# Altium schematic sheet 14.SchDoc
size 297 x 209 mm
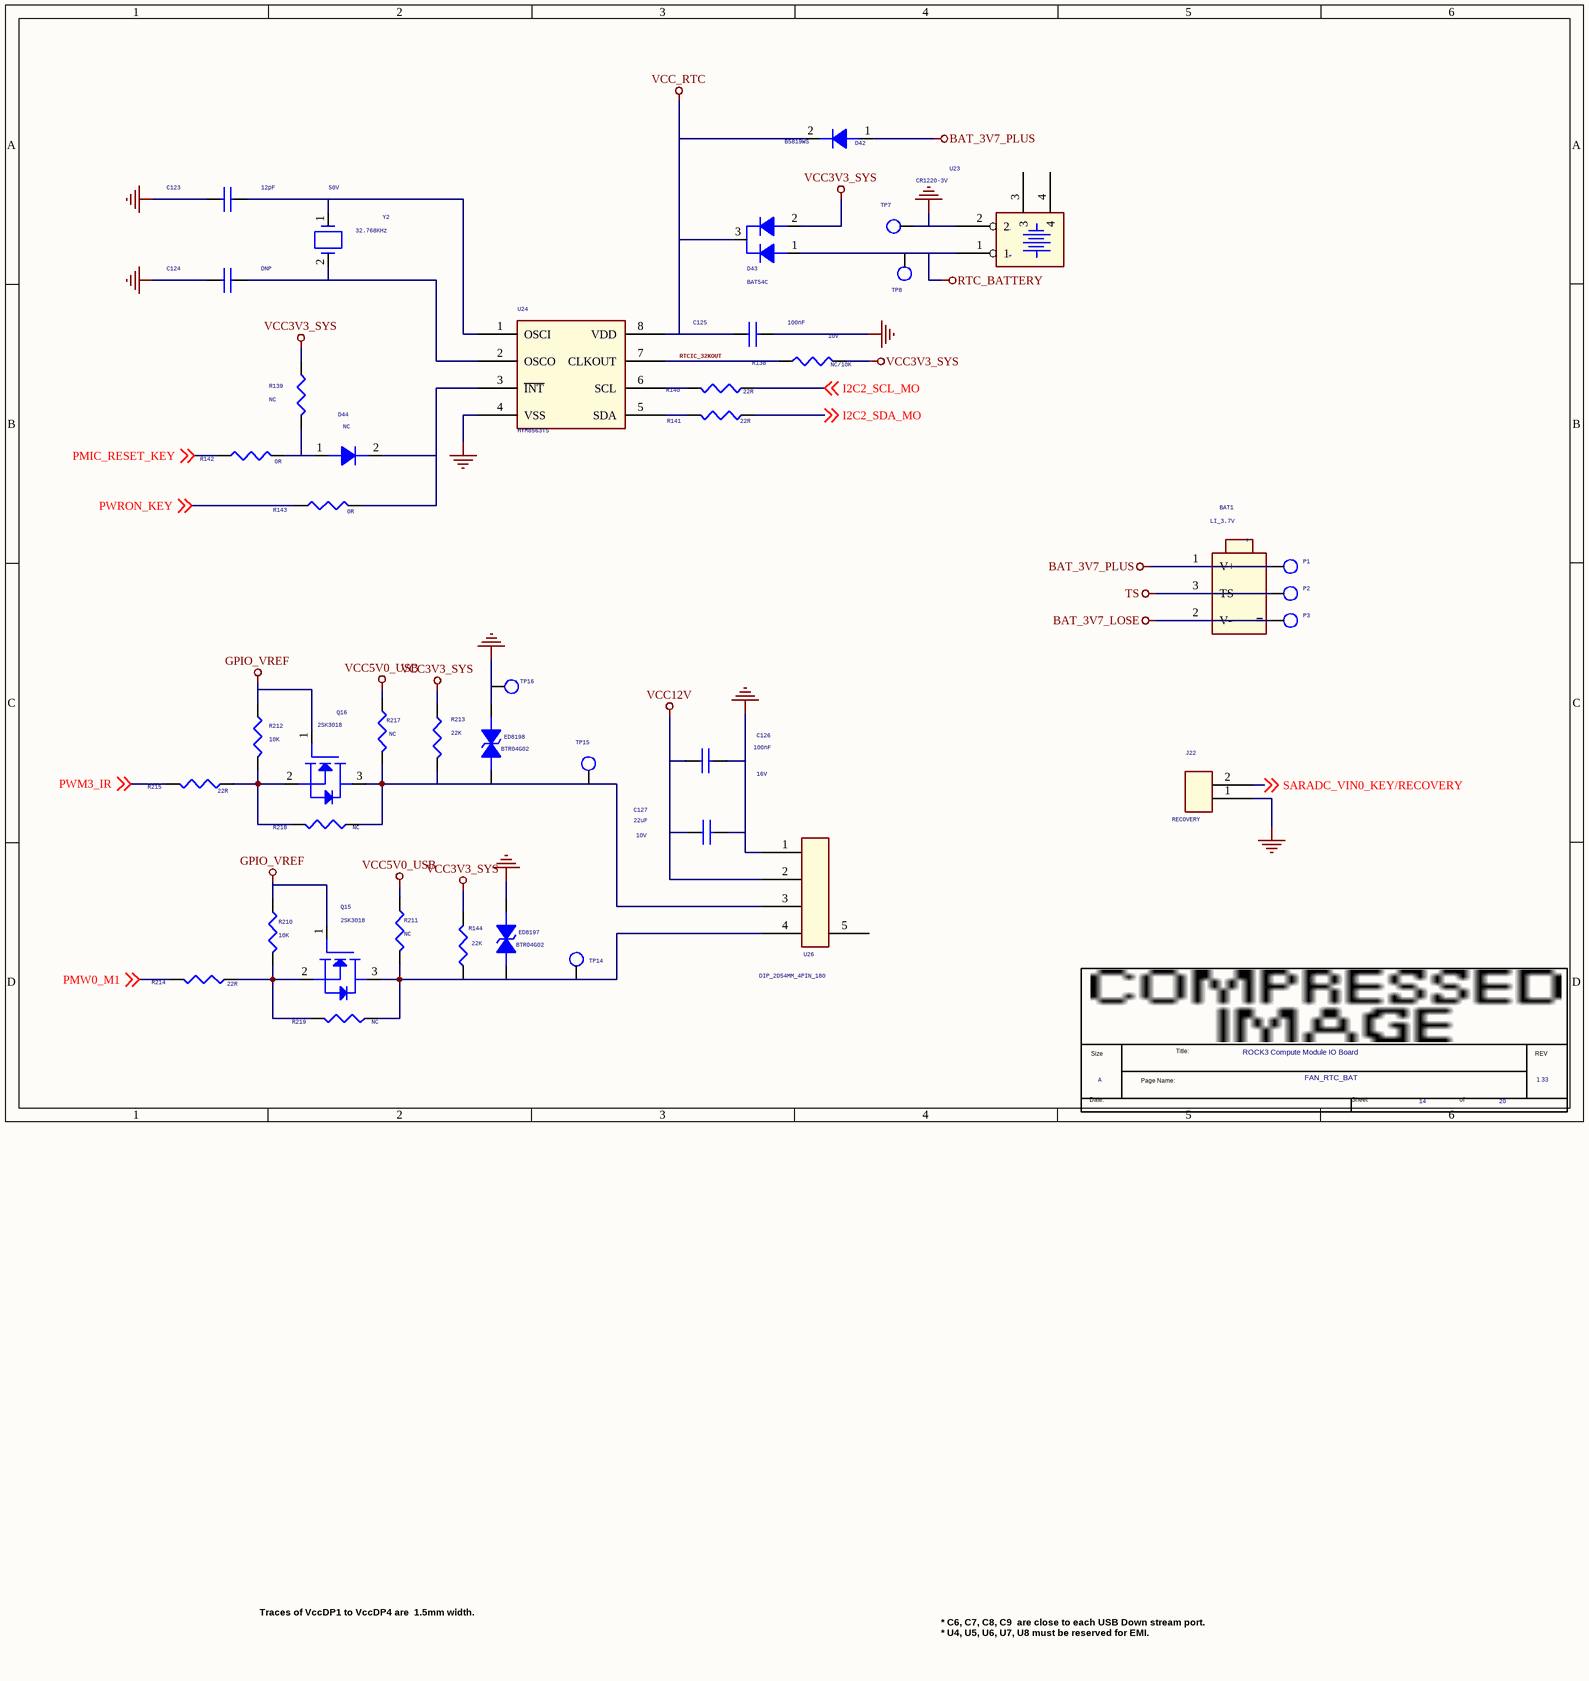
[diagram p0: 14.SchDoc]

## Parts
*  Page Count: 20  Page Number: 14  Page Size: A  Title: ROCK3 Compute Module IO Board  RevCode: 1.33  Doc: FAN_RTC_BAT  (hidden comment: radxa_1010)  (graphical)
BAT1  LI_3.7V  [SMD-3P-1.25]
C123  12pF  Voltage: 50V  [C0402]
C124  DNP  [C0402]
C125  100nF  Voltage: 10V  [C0402]
C126  100nF  Voltage: 16V  [C0402]
C127  22uF  Voltage: 10V  [C0603]
D42  B5819WS  [SOD_323]
D43  BAT54C  [SOT_23]
D44  NC  [SOD323]
ED8197  BTR04G02  [ESD0402_1xD5]
ED8198  BTR04G02  [ESD0402_1xD5]
J22  RECOVERY  [DIP2PIN-2P54MM]
P1  TEST  [TEST]  (value not drawn)
P2  TEST  [TEST]  (value not drawn)
P3  TEST  [TEST]  (value not drawn)
Q15  2SK3018  [SOT23]
Q16  2SK3018  [SOT23]
R138  NC/10K  [R0402]
R139  NC  [R0402]
R140  22R  [R0402]
R141  22R  [R0402]
R142  0R  [R0402]
R143  0R  [R0402]
R144  22K  [R0402]
R210  10K  [R0402]
R211  NC  [R0402]
R212  10K  [R0402]
R213  22K  [R0402]
R214  22R  [R0402]
R215  22R  [R0402]
R217  NC  [R0402]
R218  NC  [R0402]
R219  NC  [R0402]
TP7  TP_0.7  [TEST]  (value not drawn)
TP8  TP_0.7  [TEST]  (value not drawn)
TP14  TP_1.0  [TEST]  (value not drawn)
TP15  TP_1.0  [TEST]  (value not drawn)
TP16  TP_1.0  [TEST]  (value not drawn)
U23  CR1220-3V  [BATTERY-20MM]
U24  HYM8563TS  [MSOP8]
U26  DIP_2D54MM_4PIN_180  [470531000_4PIN]
Y2  32.768KHz  [CRY-3215]

## Nets
BAT_3V7_LOSE: BAT1.2(V-) P3.1
BAT_3V7_PLUS: BAT1.1(V+) D42.1(A) P1.1
GND: C123.2 C124.2 C125.2 C126.2 C127.2 ED8197.1 ED8198.1 J22.1 TP7.1 TP16.1 U23.2 U24.4(VSS) U26.1
GPIO_VREF: Q15.1(GATE) Q16.1(GATE) R210.1 R212.1
RTC_BATTERY: D43.1(A1) TP8.1 U23.1
TS: BAT1.3(TS) P2.1
VCC3V3_SYS: D43.2(A2) R138.2 R139.1 R144.1 R213.1
VCC5V0_USB: R211.1 R217.1
VCC12V: C126.1 C127.1 U26.2
VCC_RTC: C125.1 D42.2(K) D43.3(K) U24.8(VDD)
I2C2_SCL_MO: R140.1 ; off-sheet I2C2_SCL_MO
I2C2_SDA_MO: R141.1 ; off-sheet I2C2_SDA_MO
PMIC_RESET_KEY: R142.1 ; off-sheet PMIC_RESET_KEY
PMW0_M1: R214.2 ; off-sheet PMW0_M1
PWM3_IR: R215.2 ; off-sheet PWM3_IR
PWRON_KEY: R143.1 ; off-sheet PWRON_KEY
RTCIC_32KOUT: R138.1 U24.7(CLKOUT)
SARADC_VIN0_KEY/RECOVERY: J22.2 ; off-sheet SARADC_VIN0_KEY/RECOVERY
NetC123_1: C123.1 U24.1(OSCI) Y2.1
NetC124_1: C124.1 U24.2(OSCO) Y2.2
NetD44_1: D44.1(A) R139.2 R142.2
NetD44_2: D44.2(K) R143.2 U24.3(~{INT})
NetED8197_2: ED8197.2 Q15.3(DRAIN) R144.2 R211.2 R219.1 TP14.1 U26.4
NetED8198_2: ED8198.2 Q16.3(DRAIN) R213.2 R217.2 R218.1 TP15.1 U26.3
NetQ15_2: Q15.2(SOURCE) R210.2 R214.1 R219.2
NetQ16_2: Q16.2(SOURCE) R212.2 R215.1 R218.2
NetR140_2: R140.2 U24.6(SCL)
NetR141_2: R141.2 U24.5(SDA)

Not connected (* = marked no-connect by the designer): U23 3 4; U26 5

## Notes on the sheet
- Traces of VccDP1 to VccDP4 are  1.5mm width.
- * C6, C7, C8, C9  are close to each USB Down stream port.
  * U4, U5, U6, U7, U8 must be reserved for EMI.
- (in symbol BATTERY_1) +; -
- (in symbol CON_BATTERY-20MM_0) -; +
- (in symbol radxa_1010) Title:; Size; REV; Page Name:; Date:; Sheet; of

## Library data of the parts
BAT1 = BATTERY_1
C123 = CAP NP_0: cap,12.00pF,+/-5%,50V,C0G,C0402; Manufacturer PN: C1005C0G1H120J050BA; Manufacturer: TDK; Tolerance: 5%; Priority: A; Dielectric: C0G; Created by: JJJ; Part Type: C0402; RK PN: C1005C0G1H120J050BA
C124 = CAP NP_0: Did Not Place.; RK PN: DNPC0402; Priority: A; Part Type: DNP; Manufacturer PN: DNPC0402; Created by: JJJ
C125 = CAP NP_0: cap,100.00nF,+/-10%,10V,X5R,C0402; Manufacturer PN: C1005X5R1A104K050BA; Manufacturer: TDK; C_Voltage: 6.3V; Tolerance: 10%; Priority: A; Number: 37; Dielectric: X5R; Created by: JJJ; Part Type: C0402; RK PN: C1005X5R1A104K050BA
C126 = CAP NP_0: cap,100.00nF,+/-10%,16V,X5R,C0402; Manufacturer PN: C1005X5R1C104K050BA; Manufacturer: TDK; Tolerance: 10%; Priority: A; Dielectric: X5R; Created by: JJJ; Part Type: C0402; RK PN: C1005X5R1C104K050BA
C127 = CAP NP_0: cap,22.00uF,+/-10%,10V,X5R,C0805; Manufacturer PN: C2012X5R1A226K125AB; Manufacturer: TDK; Tolerance: 10%; Priority: A; Dielectric: X5R; Created by: JJJ; Part Type: C0805; RK PN: C2012X5R1A226K125AB
D42 D44 = DIODE_Dup2: Schottky Barrier，B5819WS SOD-323; Manufacturer: 长电; Priority: A; RK PN: B5819WS; Part Type: Schottky rectifier; Manufacturer PN: B5819WS; Created by: JJJ
D43 = DIODE Double: Dual Schottky barrier，BAT54C SOT-23 Schottky Barrier; Manufacturer: 长电; Priority: A; RK PN: BAT54C; Part Type: Schottky rectifier; Manufacturer PN: BAT54C; Created by: JJJ
ED8197 = DIODE BI_DIR TRIG_0: 1-Line, Bi-directional, Transient Voltage Suppressors.17.5pF.; Manufacturer: WillSemi(韦尔半导体); RK PN: ESD5451N; Priority: A; Part Type: ESD_TVS; Manufacturer PN: ESD5451N; Created by: JJJ
ED8198 = DIODE BI_DIR TRIG_0: 1-Line, Bi-directional, Transient Voltage Suppressors.17.5pF.; Manufacturer PN: ESD5451N; Manufacturer: WillSemi(韦尔半导体); Priority: A; Created by: JJJ; Part Type: ESD_TVS; RK PN: ESD5451N
J22 = CON2
P1-P3 = TESTPOINT1
Q15 Q16 = MOSFET N: NMOS,2SK3018,SOT_323,Id=0.1A,Vds=30V; Manufacturer: ROHM; Pd: 0.2W; Vgsth: 1.5V; VDS: 30V; Vgs: 20V; Id_max: 0.1A; Priority: A; Rds: 5ohm; Created by: JJJ; Manufacturer PN: 2SK3018; Part Type: NMOS; RK PN: 2SK3018
R138 R142 R143 = RESISTOR_0: 通用厚膜电阻,10K,+/-5%,R0402,1/16W.; Manufacturer PN: RC0402JR-0710KL; Manufacturer: YAGEO; Tolerance: 5%; option: DNP; Wattage: 1/16W; Priority: A; Created by: YTL; Part Type: 通用厚膜电阻; RK PN: RC0402JR-0710KL
R139 = RESISTOR_0: 通用厚膜电阻,10K,+/-5%,R0402,1/16W.; Manufacturer: YAGEO; Tolerance: 5%; RK PN: RC0402JR-0710KL; Priority: A; Wattage: 1/16W; option: DNP; Part Type: 通用厚膜电阻; Manufacturer PN: RC0402JR-0710KL; Created by: YTL
R140 R141 R214 R215 R218 = RESISTOR_0: 通用厚膜电阻,47K,+/-5%,R0402,1/16W.; Manufacturer: YAGEO; Tolerance: 5%; RK PN: RC0402JR-0747KL; Priority: A; Wattage: 1/16W; Part Type: 通用厚膜电阻; Manufacturer PN: RC0402JR-0747KL; Created by: YTL
R144 = RESISTOR_0: 通用厚膜电阻,47K,+/-5%,R0402,1/16W.; Manufacturer PN: RC0402JR-0747KL; Manufacturer: YAGEO; Tolerance: 1%; Wattage: 0402; Priority: A; Created by: YTL; Part Type: 通用厚膜电阻; RK PN: RC0402JR-0747KL
R210 R212 = RESISTOR_0: 通用厚膜电阻,10K,+/-5%,R0402,1/16W.; Manufacturer PN: RC0402JR-0710KL; Manufacturer: YAGEO; Tolerance: 5%; Wattage: 1/16W; Priority: A; Created by: YTL; Part Type: 通用厚膜电阻; RK PN: RC0402JR-0710KL
R211 R213 R217 = RESISTOR_0: 通用厚膜电阻,1K5,+/-5%,R0402,1/16W.; Manufacturer: YAGEO; Tolerance: 5%; RK PN: RC0402JR-071K5L; Priority: A; Wattage: 1/16W; Part Type: 通用厚膜电阻; Manufacturer PN: RC0402JR-071K5L; Created by: YTL
R219 = RESISTOR_0: 通用厚膜电阻,47K,+/-5%,R0402,1/16W.; Manufacturer PN: RC0402JR-0747KL; Manufacturer: YAGEO; Tolerance: 5%; Wattage: 1/16W; Priority: A; Created by: YTL; Part Type: 通用厚膜电阻; RK PN: RC0402JR-0747KL
TP7 TP8 = TP: Test Point 0.7mm; RK PN: TESTPOINT_0R7; Priority: A; Part Type: TP; Created by: JJJ
TP14 TP16 = TP: Test Point 1.0mm; Priority: A; RK PN: TESTPOINT_1R0; Created by: CZD; Part Type: TP
TP15 = TP: Test Point 1.0mm; RK PN: TESTPOINT_1R0; Priority: A; Part Type: TP; Created by: CZD
U23 = CON_BATTERY-20MM_0
U24 = RTC_HYM8563: I2C Real Time Clock/Calendar; Manufacturer: Haoyu（昊昱微电子）; Priority: A; Created by: JJJ; Manufacturer PN: HYM8563TS; Part Type: RTC; RK PN: HYM8563TS
U26 = CON3_1
Y2 = CRYSTAL_2P_0: 无源晶振，32.768KHz，MC-146,±20ppm，12.5pF，Hosonic; Manufacturer PN: ETDE32.768W125BMPF; Manufacturer: Hosonic(鸿星电子); Priority: A; Created by: JJJ; Part Type: CRYSTAL; RK PN: ETDE32.768W125BMPF
* = radxa_1010: Page Create Date: March  8, 1995